# EAGLE schematic CRSpill (EAGLE 9.6.2)
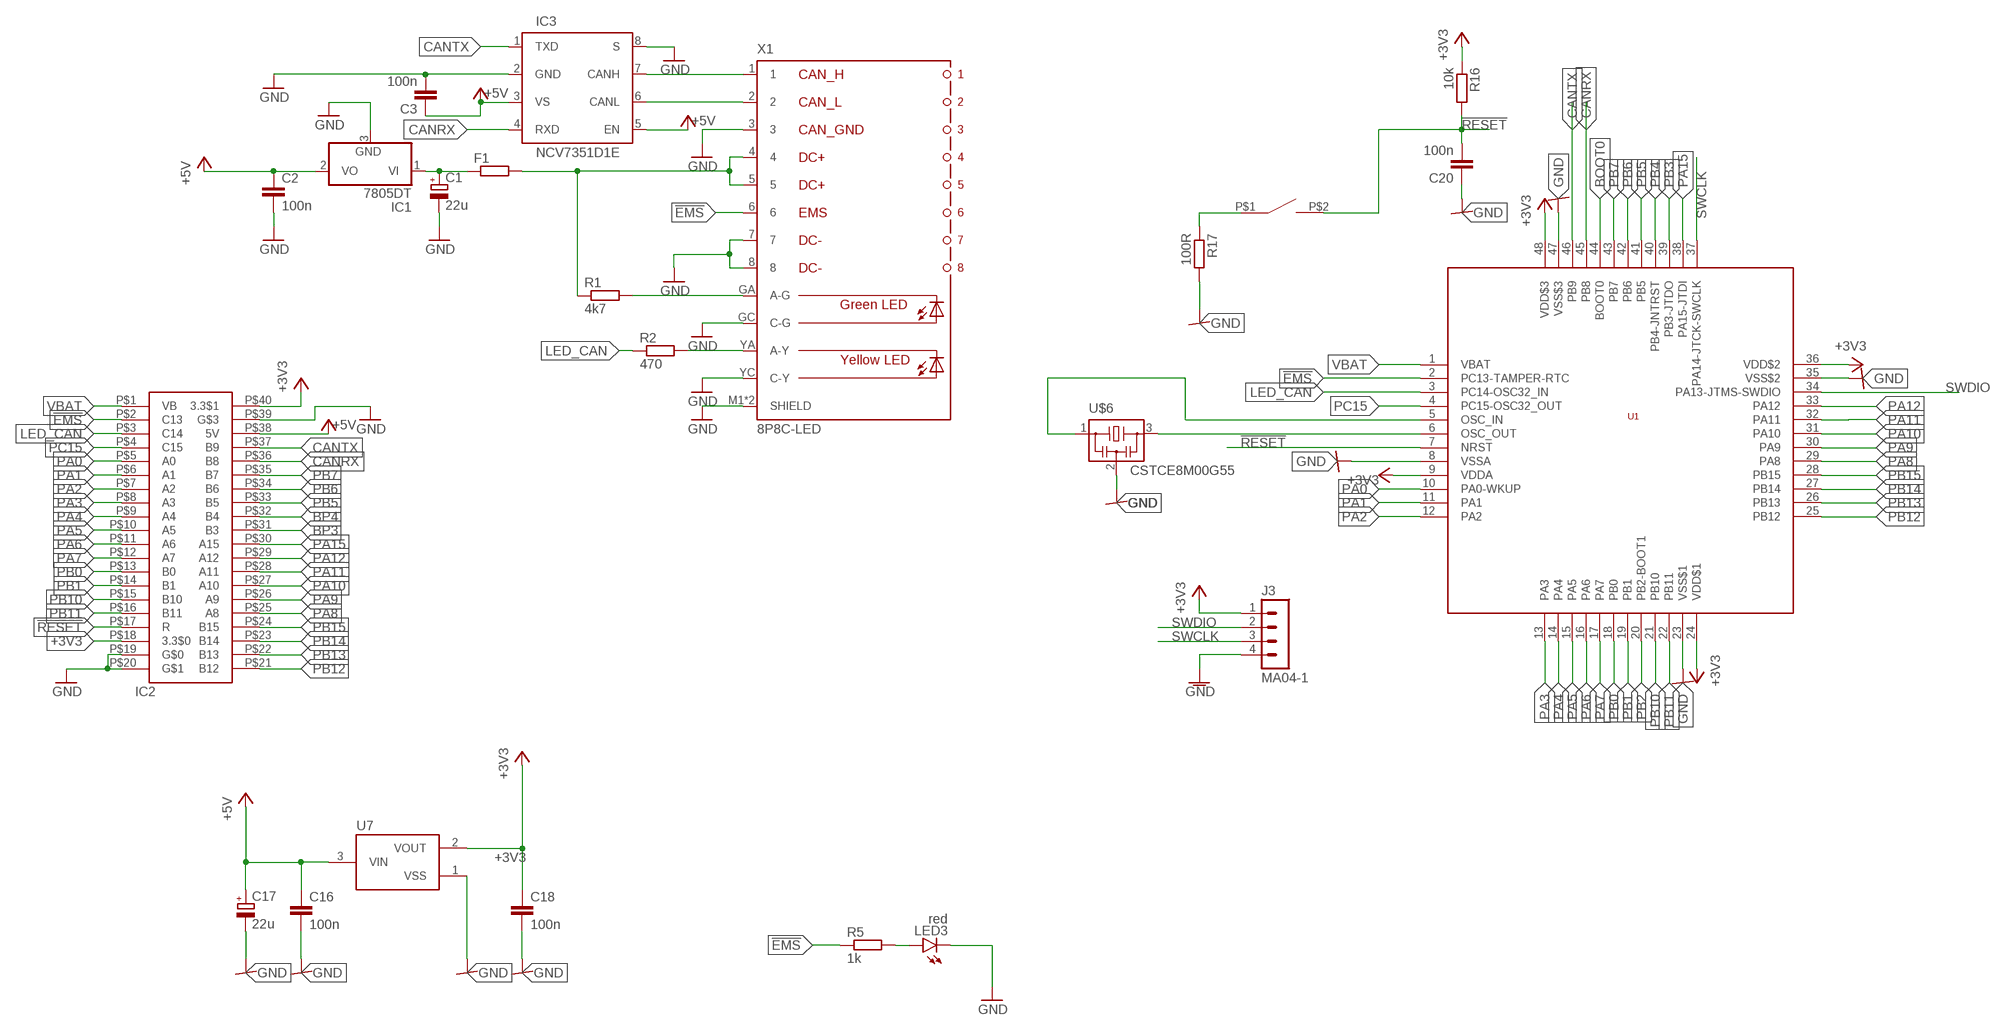
[diagram p0: schematic, sheet 1]

## Parts
C1  22u  CPOL-EUE2.5-5  [E2,5-5]
C2  100n  C-EUC0603  [C0603]
C3  100n  C-EUC0603  [C0603]
C16  100n  C-EUC0603  [C0603]
C17  22u  CPOL-EUE2-5  [E2-5]
C18  100n  C-EUC0603  [C0603]
C20  100n  C-EUC0603  [C0603]
F1  R-EU_R1206  [R1206]
IC1  7805DT  [TO252]
IC2  BLUE_PILL  [BLUE_PILL]
IC3  NCV7351D1E  [SO08]
J3  MA04-1  [MA04-1]
LED3  red  LEDCHIPLED_0805  [CHIPLED_0805]
R1  4k7  R-EU_R0603  [R0603]
R2  470  R-EU_R0603  [R0603]
R5  1k  R-EU_R0603  [R0603]
R16  10k  R-EU_R0603  [R0603]
R17  100R  R-EU_R0603  [R0603]
SW1  SWITCH_TACTILETOP  [SWITCH_TACTILE_3X6]
U1  STM32F103C8  [LQFP48]
U7  XC6206  [SOT95P240X110-3]
U$6  CSTCE8M00G55  [CSTCE8M00G55]
X1  8P8C-LED  [8P8C-LED]

## Nets
!EMS: IC2.P$2(C13) R5.1 U1.2(PC13-TAMPER-RTC) X1.6
!RESET: C20.2 IC2.P$17(R) R16.2 SW1.P$2 U1.7(NRST)
+3V3: C18.1 IC2.P$18(3.3$0) IC2.P$40(3.3$1) J3.1 R16.1 U1.9(VDDA) U1.24(VDD$1) U1.36(VDD$2) U1.48(VDD$3) U7.2(VOUT)
+5V [12v]: C2.1 C3.1 C16.1 C17.+ IC1.2(VO) IC2.P$38(5V) IC3.3(VS) IC3.5(EN) U7.3(VIN)
BOOT0: U1.44(BOOT0)
BP3: IC2.P$31(B3)
BP4: IC2.P$32(B4)
CANRX: IC2.P$36(B8) IC3.4(RXD) U1.45(PB8)
CANTX: IC2.P$37(B9) IC3.1(TXD) U1.46(PB9)
GND: C1.- C2.2 C3.2 C16.2 C17.- C18.2 C20.1 IC1.3(GND) IC2.P$19(G$0) IC2.P$20(G$1) IC2.P$39(G$3) IC3.2(GND) IC3.8(S) J3.4 LED3.C R17.2 U1.8(VSSA) U1.23(VSS$1) U1.35(VSS$2) U1.47(VSS$3) U7.1(VSS) U$6.2 X1.3 X1.7 X1.8 X1.GC(C-G) X1.M1(SHIELD) X1.M2(SHIELD) X1.YC(C-Y) ; supply symbol labelled GNDIO, GNDA
LED_CAN: IC2.P$3(C14) R2.1 U1.3(PC14-OSC32_IN)
N$1: R1.2 X1.GA(A-G)
N$2 [12v]: F1.2 R1.1 X1.4 X1.5
N$3 [12v]: C1.+ F1.1 IC1.1(VI)
N$4: IC3.7(CANH) X1.1
N$5: IC3.6(CANL) X1.2
N$9: R2.2 X1.YA(A-Y)
N$11: U1.6(OSC_OUT) U$6.3
N$15: LED3.A R5.2
N$16: R17.1 SW1.P$1
N$19: U1.5(OSC_IN) U$6.1
PA0: IC2.P$5(A0) U1.10(PA0-WKUP)
PA1: IC2.P$6(A1) U1.11(PA1)
PA2: IC2.P$7(A2) U1.12(PA2)
PA3: IC2.P$8(A3) U1.13(PA3)
PA4: IC2.P$9(A4) U1.14(PA4)
PA5: IC2.P$10(A5) U1.15(PA5)
PA6: IC2.P$11(A6) U1.16(PA6)
PA7: IC2.P$12(A7) U1.17(PA7)
PA8: IC2.P$25(A8) U1.29(PA8)
PA9: IC2.P$26(A9) U1.30(PA9)
PA10: IC2.P$27(A10) U1.31(PA10)
PA11: IC2.P$28(A11) U1.32(PA11)
PA12: IC2.P$29(A12) U1.33(PA12)
PA15: IC2.P$30(A15) U1.38(PA15-JTDI)
PB0: IC2.P$13(B0) U1.18(PB0)
PB1: IC2.P$14(B1) U1.19(PB1)
PB2: U1.20(PB2-BOOT1)
PB3: U1.39(PB3-JTDO)
PB4: U1.40(PB4-JNTRST)
PB5: IC2.P$33(B5) U1.41(PB5)
PB6: IC2.P$34(B6) U1.42(PB6)
PB7: IC2.P$35(B7) U1.43(PB7)
PB10: IC2.P$15(B10) U1.21(PB10)
PB11: IC2.P$16(B11) U1.22(PB11)
PB12: IC2.P$21(B12) U1.25(PB12)
PB13: IC2.P$22(B13) U1.26(PB13)
PB14: IC2.P$23(B14) U1.27(PB14)
PB15: IC2.P$24(B15) U1.28(PB15)
PC15: IC2.P$4(C15) U1.4(PC15-OSC32_OUT)
SWCLK: J3.3 U1.37(PA14-JTCK-SWCLK)
SWDIO: J3.2 U1.34(PA13-JTMS-SWDIO)
VBAT: IC2.P$1(VB) U1.1(VBAT)

## Library data of the parts
C1 = rcl:CPOL-EU: POLARIZED CAPACITOR, European symbol; SPICEPREFIX: C
C2 C3 = rcl:C-EU: CAPACITOR, European symbol; SPICEPREFIX: C
C16 C18 C20 = rcl:C-EU: CAPACITOR, European symbol
C17 = rcl:CPOL-EU: POLARIZED CAPACITOR, European symbol
F1 R1 R2 R5 = rcl:R-EU_: RESISTOR, European symbol; SPICEPREFIX: R
IC1 = linear:78*: Positive VOLTAGE REGULATOR Source: http://cache.national.com/ds/LM/LM78L05.pdf http://www.fairchildsemi.com/ds/LM/LM7805.pdf
IC2 = stm32_mcu:BLUE_PILL
IC3 = on-semi:NCV7351D1E: High Speed CAN Transceiver Source: NCV7351-D.PDF <http://www.onsemi.com/PowerSolutions/document/NCV7351-D.PDF>
J3 = con-headers:MA04-1
LED3 = led:LED: LED OSRAM: - CHIPLED LG R971, LG N971, LY N971, LG Q971, LY Q971, LO R971, LY R971 LH N974, LH R974 LS Q976, LO Q976, LY Q976 LO Q996 - Hyper CHIPLED LW Q18S LB Q993, LB Q99A, LB R99A - SideLED LS A670, LO A670, LY A670, LG A670, LP A670 LB A673, LV A673, LT A673, LW A673 LH A674 LY A675 LS A676, LA A676, LO A676, LY A676, LW A676 LS A679, LY A679, LG A679 - Hyper Micro SIDELED® LS Y876, LA Y876, LO Y876, LY Y876 LT Y87S - SmartLED LW L88C, LW L88S LB L89C, LB L89S, LG L890 LS L89K, LO L89K, LY L89K LS L896, LA L896, LO L896, LY L896 - TOPLED LS T670, LO T670, LY T670, LG T670, LP T670 LSG T670, LSP T670, LSY T670, LOP T670, LYG T670 LG T671, LOG T671, LSG T671 LB T673, LV T673, LT T673, LW T673 LH T674 LS T676, LA T676, LO T676, LY T676, LB T676, LH T676, LSB T676, LW T676 LB T67C, LV T67C, LT T67C, LS T67K, LO T67K, LY T67K, LW E67C LS E67B, LA E67B, LO E67B, LY E67B, LB E67C, LV E67C, LT E67C LW T67C LS T679, LY T679, LG T679 LS T770, LO T770, LY T770, LG T770, LP T770 LB T773, LV T773, LT T773, LW T773 LH T774 LS E675, LA E675, LY E675, LS T675 LS T776, LA T776, LO T776, LY T776, LB T776 LHGB T686 LT T68C, LB T68C - Hyper Mini TOPLED® LB M676 - Mini TOPLED Santana® LG M470 LS M47K, LO M47K, LY M47K Source: http://www.osram.convergy.de LUXEON: - LUMILED® LXK2-PW12-R00, LXK2-PW12-S00, LXK2-PW14-U00, LXK2-PW14-V00 LXK2-PM12-R00, LXK2-PM12-S00, LXK2-PM14-U00 LXK2-PE12-Q00, LXK2-PE12-R00, LXK2-PE12-S00, LXK2-PE14-T00, LXK2-PE14-U00 LXK2-PB12-K00, LXK2-PB12-L00, LXK2-PB12-M00, LXK2-PB14-N00, LXK2-PB14-P00, LXK2-PB14-Q00 LXK2-PR12-L00, LXK2-PR12-M00, LXK2-PR14-Q00, LXK2-PR14-R00 LXK2-PD12-Q00, LXK2-PD12-R00, LXK2-PD12-S00 LXK2-PH12-R00, LXK2-PH12-S00 LXK2-PL12-P00, LXK2-PL12-Q00, LXK2-PL12-R00 Source: www.luxeon.com KINGBRIGHT: KA-3528ASYC Source: www.kingbright.com
R16 R17 = rcl:R-EU_: RESISTOR, European symbol
SW1 = switch-tactile:SWITCH_TACTILE
U1 = stm32_mcu:STM32F103C8: STMicroelectronics STM32F103C8 Mainstream Performance line, ARM Cortex-M3 MCU with 64 Kbytes Flash, 72 MHz CPU, motor control, USB and CAN references: datasheet <https://www.st.com/resource/en/datasheet/stm32f103c8.pdf> product page <https://www.st.com/ja/microcontrollers/stm32f103c8.html>
U7 = torex:XC6206
U$6 = resonator:CSTCE8M00G55
X1 = con-rj45:8P8C-LED: generic 8P8C connector with two LED's; OC_FARNELL: unknown; OC_NEWARK: unknown

## Net classes
1 12v: width 0.5 mm